# EAGLE design EHM (EAGLE 9.3.0)

## Sheet 1 of 2
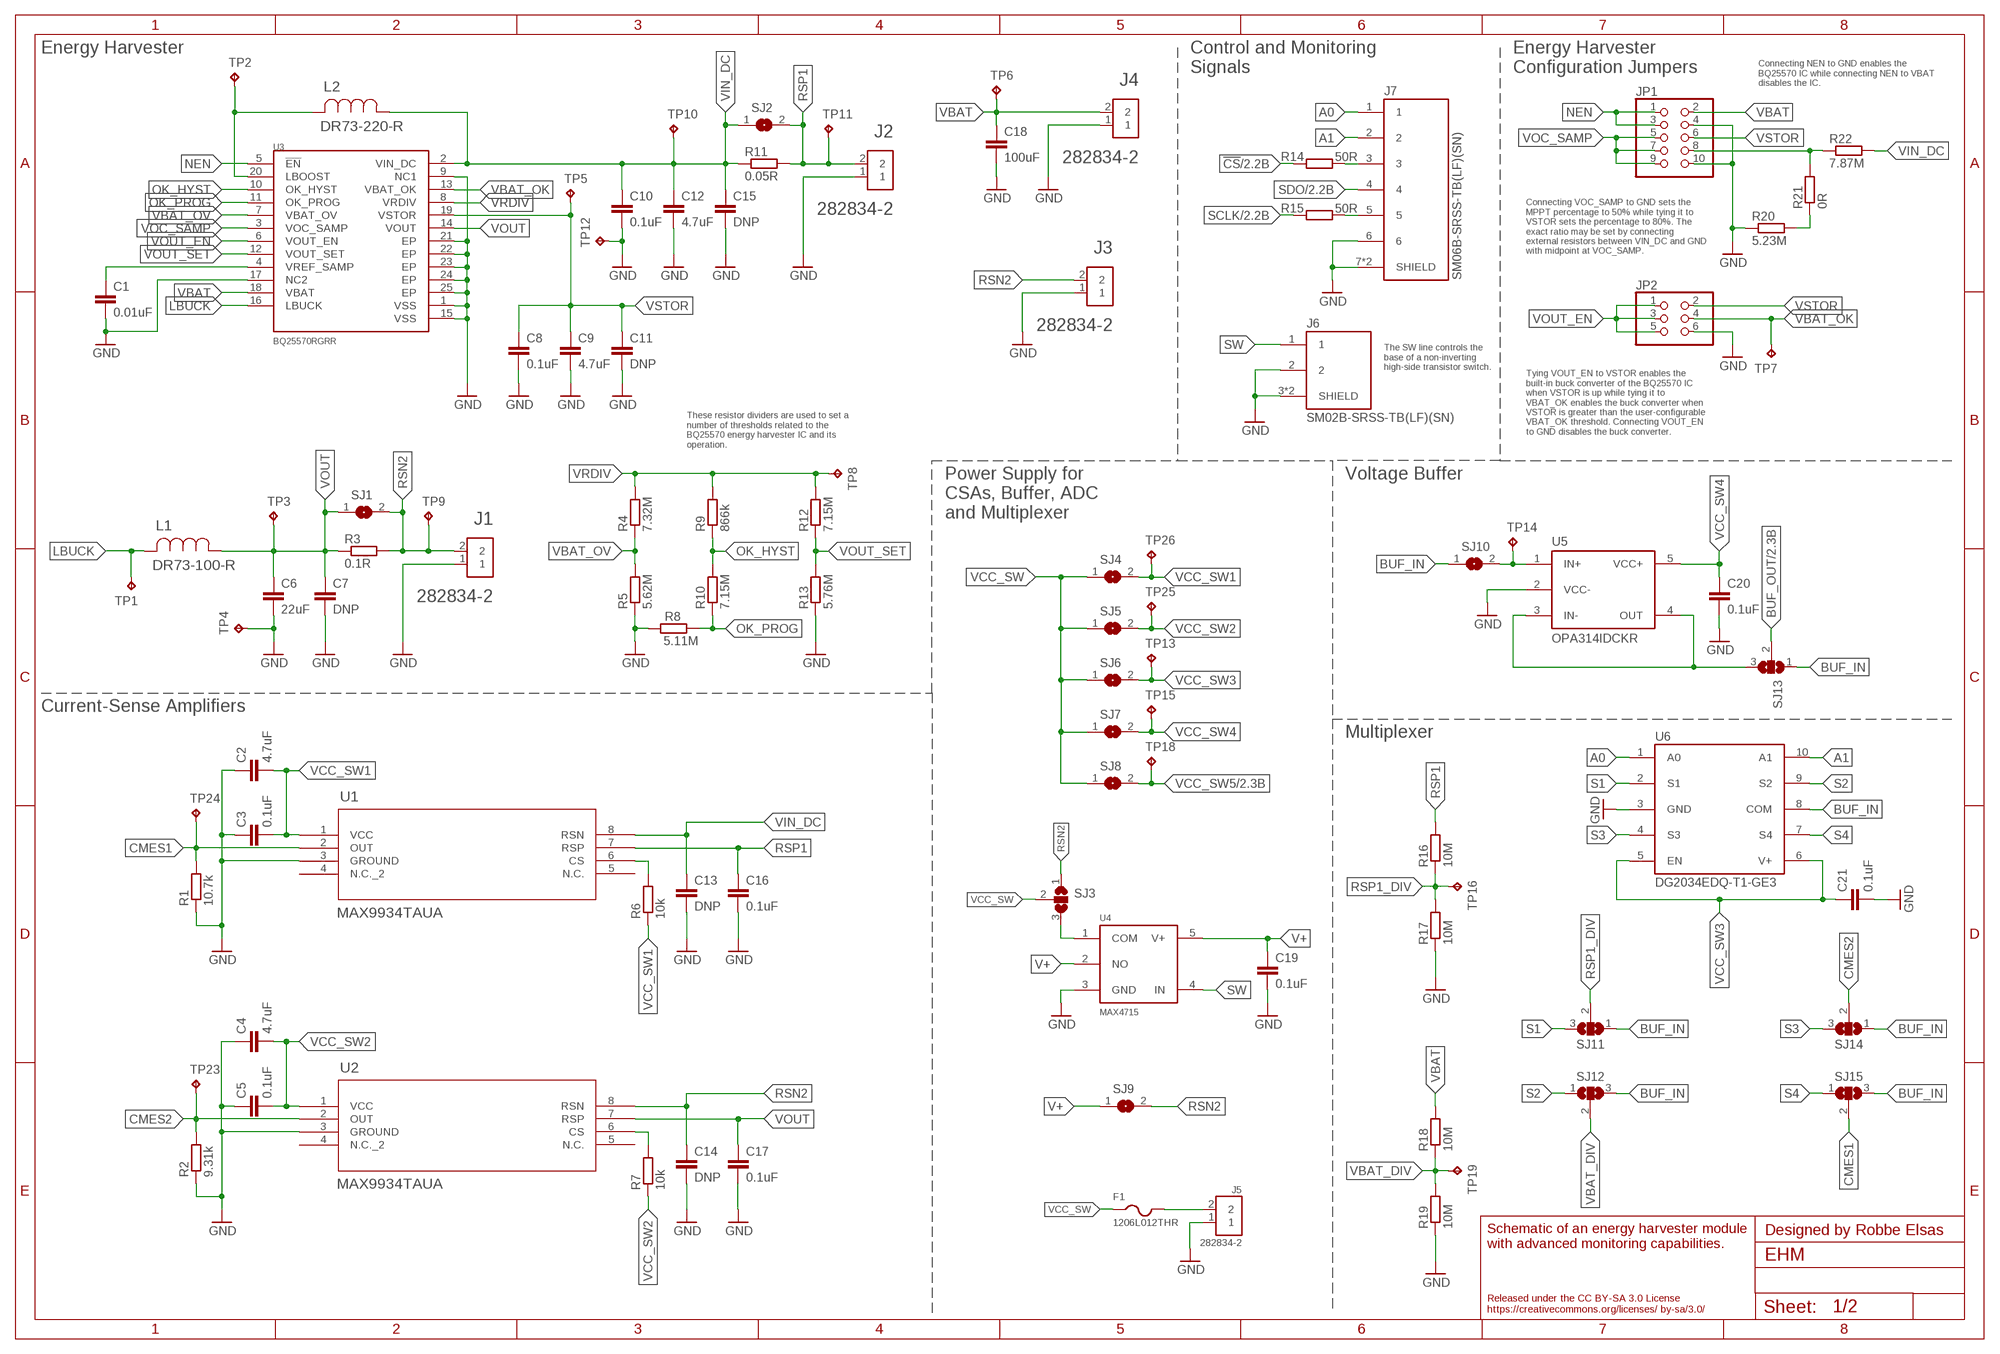
[diagram p0: schematic, sheet 1]

### Parts
C1  0.01uF  C-EUC0805  [C0805]
C2  4.7uF  C-EUC0805  [C0805]
C3  0.1uF  C-EUC0805  [C0805]
C4  4.7uF  C-EUC0805  [C0805]
C5  0.1uF  C-EUC0805  [C0805]
C6  22uF  C-EUC0805  [C0805]
C7  DNP  C-EUC0805  [C0805]
C8  0.1uF  C-EUC0805  [C0805]
C9  4.7uF  C-EUC0805  [C0805]
C10  0.1uF  C-EUC0805  [C0805]
C11  DNP  C-EUC0805  [C0805]
C12  4.7uF  C-EUC0805  [C0805]
C13  DNP  C-EUC0805  [C0805]
C14  DNP  C-EUC0805  [C0805]
C15  DNP  C-EUC0805  [C0805]
C16  0.1uF  C-EUC0805  [C0805]
C17  0.1uF  C-EUC0805  [C0805]
C18  100uF  C-EUC1210  [C1210]
C19  0.1uF  C-EUC0805  [C0805]
C20  0.1uF  C-EUC0805  [C0805]
C21  0.1uF  C-EUC0805  [C0805]
F1  1206L012THR  [R1206]
J1  282834-2  [CONN_282834-2]
J2  282834-2  [CONN_282834-2]
J3  282834-2  [CONN_282834-2]
J4  282834-2  [CONN_282834-2]
J5  282834-2  [CONN_282834-2]
J6  SM02B-SRSS-TB(LF)(SN)  [SM02B-SRSS-TB]
J7  SM06B-SRSS-TB(LF)(SN)  [SM06B-SRSS-B]
JP1  PINHD-2X5  [2X05]
JP2  PINHD-2X3  [2X03]
L1  DR73-100-R  [DR73]
L2  DR73-220-R  [DR73]
R1  10.7k  R-EU_R0603  [R0603]
R2  9.31k  R-EU_R0603  [R0603]
R3  0.1R  Y14870RXX000B9R  [Y14870RXX000B9R]
R4  7.32M  R-EU_R0603  [R0603]
R5  5.62M  R-EU_R0603  [R0603]
R6  10k  R-EU_R0603  [R0603]
R7  10k  R-EU_R0603  [R0603]
R8  5.11M  R-EU_R0603  [R0603]
R9  866k  R-EU_R0603  [R0603]
R10  7.15M  R-EU_R0603  [R0603]
R11  0.05R  Y14870RXX000B9R  [Y14870RXX000B9R]
R12  7.15M  R-EU_R0603  [R0603]
R13  5.76M  R-EU_R0603  [R0603]
R14  50R  R-EU_R0603  [R0603]
R15  50R  R-EU_R0603  [R0603]
R16  10M  R-EU_R0603  [R0603]
R17  10M  R-EU_R0603  [R0603]
R18  10M  R-EU_R0603  [R0603]
R19  10M  R-EU_R0603  [R0603]
R20  5.23M  R-EU_R0603  [R0603]
R21  0R  R-EU_R0603  [R0603]
R22  7.87M  R-EU_R0603  [R0603]
SJ1  SJ  [SJ]
SJ2  SJ  [SJ]
SJ3  SJ2W  [SJ_2]
SJ4  SJ  [SJ]
SJ5  SJ  [SJ]
SJ6  SJ  [SJ]
SJ7  SJ  [SJ]
SJ8  SJ  [SJ]
SJ9  SJ  [SJ]
SJ10  SJ  [SJ]
SJ11  SJ2W  [SJ_2]
SJ12  SJ2W  [SJ_2]
SJ13  SJ2W  [SJ_2]
SJ14  SJ2W  [SJ_2]
SJ15  SJ2W  [SJ_2]
TP1  TPPAD1-13  [P1-13]
TP2  TPB1,27  [B1,27]
TP3  TPB1,27  [B1,27]
TP4  TPPAD1-13  [P1-13]
TP5  TPB1,27  [B1,27]
TP6  TPPAD1-13  [P1-13]
TP7  TPPAD1-13  [P1-13]
TP8  TPPAD1-13  [P1-13]
TP9  TPB1,27  [B1,27]
TP10  TPB1,27  [B1,27]
TP11  TPPAD1-13  [P1-13]
TP12  TPPAD1-13  [P1-13]
TP13  TPB1,27  [B1,27]
TP14  TPB1,27  [B1,27]
TP15  TPB1,27  [B1,27]
TP16  TPPAD1-13  [P1-13]
TP18  TPB1,27  [B1,27]
TP19  TPPAD1-13  [P1-13]
TP23  TPPAD1-13  [P1-13]
TP24  TPPAD1-13  [P1-13]
TP25  TPB1,27  [B1,27]
TP26  TPB1,27  [B1,27]
U1  MAX9934TAUA  [21-0036K]
U2  MAX9934TAUA  [21-0036K]
U3  BQ25570RGRR  [QFN50P350X350X100-21N]
U4  MAX4715  [SC70-5L]
U5  OPA314IDCKR  [SC70-5L]
U6  DG2034EDQ-T1-GE3  [MSOP10]

### Nets
!CS!: R14.1 ; also sheet 2
A0: J7.1 U6.1(A0)
A1: J7.2 U6.10(A1)
BUF_IN: SJ10.1 SJ11.1 SJ12.3 SJ13.1 SJ14.1 SJ15.3 U6.8(COM)
BUF_OUT: SJ13.2 ; also sheet 2
CMES1: R1.2 SJ15.2 TP24.TP U1.2(OUT)
CMES2: R2.2 SJ14.2 TP23.TP U2.2(OUT)
GND: C1.2 C2.1 C3.1 C4.1 C5.1 C6.2 C7.2 C8.2 C9.2 C10.2 C11.2 C12.2 C13.2 C14.2 C15.2 C16.2 C17.2 C18.2 C19.2 C20.2 C21.2 J1.1 J2.1 J3.1 J4.1 J5.1 J6.2 J6.3(SHIELD) J6.4(SHIELD) J7.6 J7.7(SHIELD) J7.8(SHIELD) JP1.4 JP1.10 JP2.6 R1.1 R2.1 R5.1 R8.1 R13.1 R17.1 R19.1 R20.1 TP4.TP TP12.TP U1.3(GROUND) U2.3(GROUND) U3.1(VSS) U3.9(NC1) U3.15(VSS) U3.17(NC2) U3.21(EP) U3.22(EP) U3.23(EP) U3.24(EP) U3.25(EP) U4.3(GND) U5.2(VCC-) U6.3(GND) ; also sheet 2
LBOOST: L2.2 TP2.TP U3.20(LBOOST)
LBUCK: L1.2 TP1.TP U3.16(LBUCK)
N$2: R20.2 R21.1
N$3: JP1.8 R21.2 R22.1
N$4: R6.2 U1.6(CS)
N$6: F1.2 J5.2
N$7: R7.2 U2.6(CS)
N$8: SJ10.2 TP14.TP U5.1(IN+)
N$9: J7.3 R14.2
N$10: SJ3.3 U4.1(COM)
N$12: J7.5 R15.2
N$27: SJ13.3 U5.3(IN-) U5.4(OUT)
NEN: JP1.1 JP1.3 U3.5(!EN)
OK_HYST: R9.1 R10.2 U3.10(OK_HYST)
OK_PROG: R8.2 R10.1 U3.11(OK_PROG)
RSN2: C14.1 J1.2 J3.2 R3.P$3 R3.P$4 SJ1.2 SJ3.1 SJ9.2 TP9.TP U2.8(RSN)
RSP1: C16.1 J2.2 R11.P$3 R11.P$4 R16.2 SJ2.2 TP11.TP U1.7(RSP)
RSP1_DIV: R16.1 R17.2 SJ11.2 TP16.TP
S1: SJ11.3 U6.2(S1)
S2: SJ12.1 U6.9(S2)
S3: SJ14.3 U6.4(S3)
S4: SJ15.1 U6.7(S4)
SCLK: R15.1 ; also sheet 2
SDO: J7.4 ; also sheet 2
SW: J6.1 U4.4(IN)
V+: C19.1 SJ9.1 U4.2(NO) U4.5(V+)
VBAT: C18.1 J4.2 JP1.2 R18.2 TP6.TP U3.18(VBAT)
VBAT_DIV: R18.1 R19.2 SJ12.2 TP19.TP
VBAT_OK: JP2.4 TP7.TP U3.13(VBAT_OK)
VBAT_OV: R4.1 R5.2 U3.7(VBAT_OV)
VCC_SW: F1.1 SJ3.2 SJ4.1 SJ5.1 SJ6.1 SJ7.1 SJ8.1
VCC_SW1: C2.2 C3.2 R6.1 SJ4.2 TP26.TP U1.1(VCC)
VCC_SW2: C4.2 C5.2 R7.1 SJ5.2 TP25.TP U2.1(VCC)
VCC_SW3: C21.1 SJ6.2 TP13.TP U6.5(EN) U6.6(V+)
VCC_SW4: C20.1 SJ7.2 TP15.TP U5.5(VCC+)
VCC_SW5: SJ8.2 TP18.TP ; also sheet 2
VIN_DC: C10.1 C12.1 C13.1 C15.1 L2.1 R11.P$1 R11.P$2 R22.2 SJ2.1 TP10.TP U1.8(RSN) U3.2(VIN_DC)
VOC_SAMP: JP1.5 JP1.7 JP1.9 U3.3(VOC_SAMP)
VOUT: C6.1 C7.1 C17.1 L1.1 R3.P$1 R3.P$2 SJ1.1 TP3.TP U2.7(RSP) U3.14(VOUT)
VOUT_EN: JP2.1 JP2.3 JP2.5 U3.6(VOUT_EN)
VOUT_SET: R12.1 R13.2 U3.12(VOUT_SET)
VRDIV: R4.2 R9.2 R12.2 TP8.TP U3.8(VRDIV)
VREF_SAMP: C1.1 U3.4(VREF_SAMP)
VSTOR: C8.1 C9.1 C11.1 JP1.6 JP2.2 TP5.TP U3.19(VSTOR)
Unconnected: U1.4(N.C._2) U1.5(N.C.) U2.4(N.C._2) U2.5(N.C.)

### Notes on the sheet
- Energy Harvester
- Control and Monitoring
  Signals
- Energy Harvester 
  Configuration Jumpers
- Connecting NEN to GND enables the 
  BQ25570 IC while connecting NEN to VBAT 
  disables the IC.
- Connecting VOC_SAMP to GND sets the 
  MPPT percentage to 50% while tying it to 
  VSTOR sets the percentage to 80%. The 
  exact ratio may be set by connecting 
  external resistors between VIN_DC and GND 
  with midpoint at VOC_SAMP.
- The SW line controls the 
  base of a non-inverting 
  high-side transistor switch.
- Tying VOUT_EN to VSTOR enables the 
  built-in buck converter of the BQ25570 IC 
  when VSTOR is up while tying it to 
  VBAT_OK enables the buck converter when 
  VSTOR is greater than the user-configurable 
  VBAT_OK threshold. Connecting VOUT_EN 
  to GND disables the buck converter.
- These resistor dividers are used to set a 
  number of thresholds related to the 
  BQ25570 energy harvester IC and its 
  operation.
- Voltage Buffer
- Power Supply for
  CSAs, Buffer, ADC
  and Multiplexer
- Current-Sense Amplifiers
- Multiplexer
- Designed by Robbe Elsas
- Schematic of an energy harvester module 
  with advanced monitoring capabilities.
- Released under the CC BY-SA 3.0 License 
  https://creativecommons.org/licenses/ by-sa/3.0/

## Sheet 2 of 2
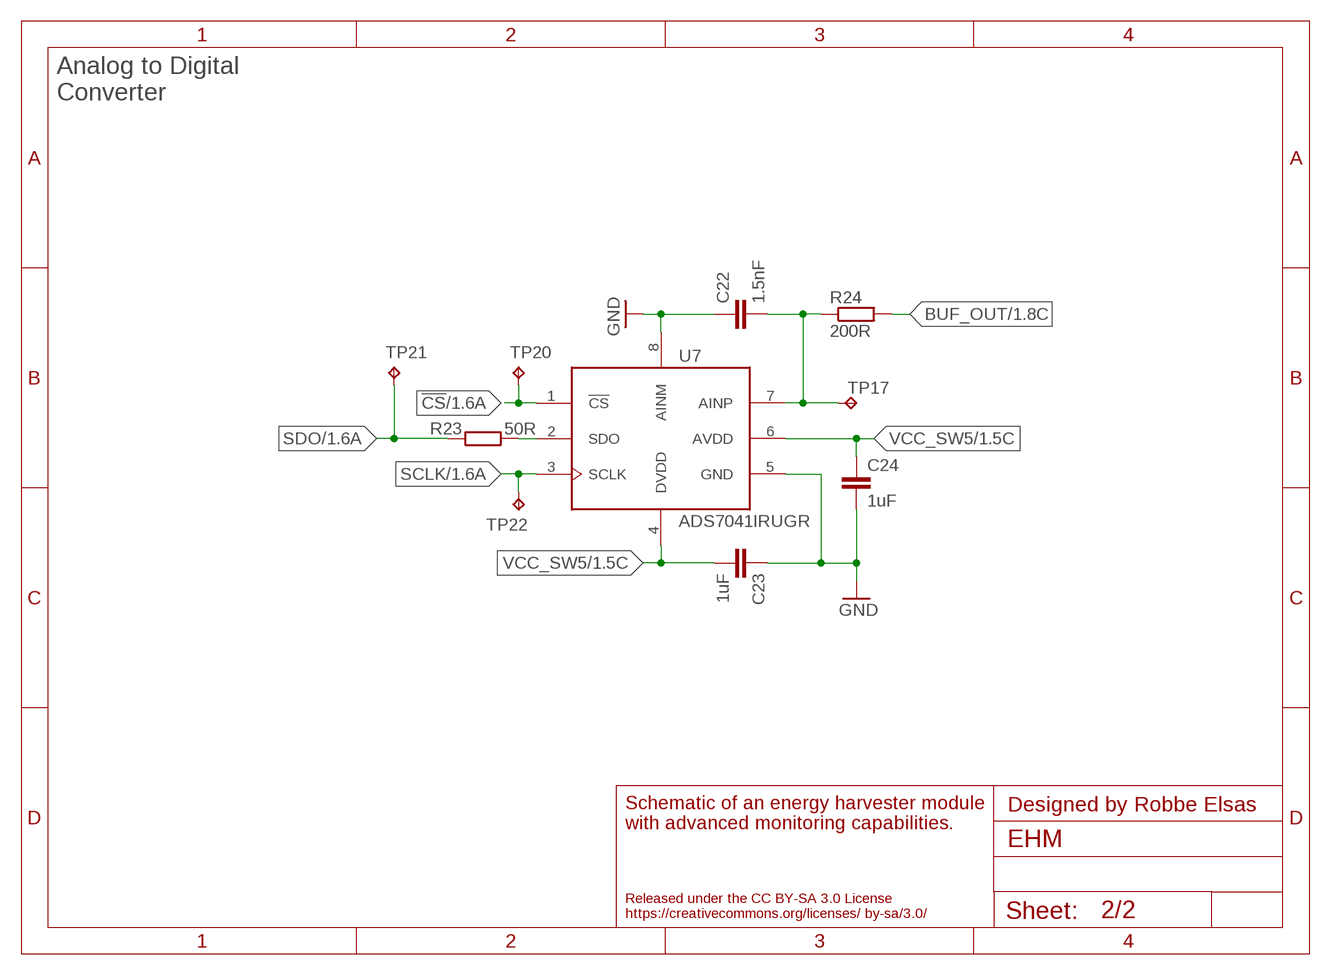
[diagram p1: schematic, sheet 2]

### Parts
C22  1.5nF  C-EUC0603  [C0603]
C23  1uF  C-EUC0805  [C0805]
C24  1uF  C-EUC0805  [C0805]
R23  50R  R-EU_R0603  [R0603]
R24  200R  R-EU_R0603  [R0603]
TP17  TPB1,27  [B1,27]
TP20  TPB1,27  [B1,27]
TP21  TPB1,27  [B1,27]
TP22  TPB1,27  [B1,27]
U7  ADS7041IRUGR  [QFN50P150X150X40-8N]

### Nets
!CS!: TP20.TP U7.1(!CS!) ; also sheet 1
BUF_OUT: R24.2 ; also sheet 1
GND: C22.1 C23.1 C24.2 U7.5(GND) U7.8(AINM) ; also sheet 1
N$5: R23.2 U7.2(SDO)
N$13: C22.2 R24.1 TP17.TP U7.7(AINP)
SCLK: TP22.TP U7.3(SCLK) ; also sheet 1
SDO: R23.1 TP21.TP ; also sheet 1
VCC_SW5: C23.2 C24.1 U7.4(DVDD) U7.6(AVDD) ; also sheet 1

### Notes on the sheet
- Analog to Digital
  Converter
- Designed by Robbe Elsas
- Schematic of an energy harvester module 
  with advanced monitoring capabilities.
- Released under the CC BY-SA 3.0 License 
  https://creativecommons.org/licenses/ by-sa/3.0/

## Library data of the parts
C1-C24 = rcl:C-EU: CAPACITOR, European symbol; SPICEPREFIX: C
F1 = 1206L012THR:1206L012THR
J1-J5 = 282834-2:282834-2: Terminal block; 2.54mm; angled 90°; 0.03÷1mm2; ways: 2; 10A; H: 10mm; AVAILABILITY: Unavailable; CENTERLINE_PITCH: 2.54 mm[.1 in]; COMMENT: 282834-2; DESCRIPTION: TERMI-BLOK PCB MOUNT, 90 2P.; EU_ROHS_COMPLIANCE: Compliant with Exemptions; MF: TE Connectivity; MP: 282834-2; NUMBER_OF_POSITIONS: 2; PACKAGE: None; PRICE: None; TE_PURCHASE_URL: https://www.te.com/usa-en/product-282834-2.html?te_bu=Cor&te_type=disp&te_campaign=seda_glo_cor-seda-global-disp-prtnr-fy19-seda-model-bom-cta_sma-317_1&elqCampaignId=32493
J6 = SM02B-SRSS-TB(LF)(SN):SM02B-SRSS-TB(LF)(SN): CONN HEADER SH 2POS SIDE 1MM TIN Source: Datasheet <http://www.jst-mfg.com/product/pdf/eng/eSH.pdf>
J7 = SM06B-SRSS-TB(LF)(SN):SM06B-SRSS-TB(LF)(SN): JST (JAPAN SOLDERLESS TERMINALS) - SM06B-SRSS-TB(LF)(SN) - CONNECTOR, HEADER, SMT, R/A, 1MM, 6WAY Source: Datasheet <http://www.jst-mfg.com/product/pdf/eng/eSH.pdf>
JP1 = pinhead:PINHD-2X5: PIN HEADER
JP2 = pinhead:PINHD-2X3: PIN HEADER
L1 = DR73-100-R:DR73-100-R: POWER INDUCTOR
L2 = DR73-220-R:DR73-220-R: POWER INDUCTOR
R1 R2 R4-R10 R12-R24 = rcl:R-EU_: RESISTOR, European symbol; SPICEPREFIX: R
R3 R11 = Y14870RXX000B9R:Y14870RXX000B9R
SJ1 SJ2 SJ4-SJ10 = jumper:SJ: SMD solder JUMPER
SJ3 SJ11-SJ15 = jumper:SJ2W: SMD solder JUMPER
TP1-TP26 = testpad:TP: Test pad
U1 U2 = MAX9934TAUA:MAX9934TAUA; DESCRIPTION: Linear IC - Op-amp Maxim Integrated MAX9934TAUA+ Current sensor uMAX 8; DIGI-KEY_PART_NUMBER: MAX9934TAUA+-ND; DIGI-KEY_PURCHASE_URL: https://www.digikey.be/product-detail/en/maxim-integrated/MAX9934TAUA-/MAX9934TAUA--ND/2239130?utm_source=snapeda&utm_medium=aggregator&utm_campaign=symbol; MF: Maxim Integrated; MP: MAX9934TAUA+; PACKAGE: MSOP-8 Maxim Integrated
U3 = BQ25570RGRR:BQ25570RGRR: Ultra Low Power Harvester Power Management IC with Boost Charger, and Nanopower Buck Converter 20-VQFN; AVAILABILITY: Unavailable; DESCRIPTION: Ultra Low Power Harvester Power Management IC with Boost Charger, and Nanopower Buck Converter 20-VQFN; MF: Texas Instruments; MP: BQ25570RGRR; PACKAGE: VQFN-20 Texas Instruments; PRICE: None
U4 = MAX4715:MAX4715
U5 = OPA314IDCK:OPA314IDCKR
U6 = DG2034EDQ-T1-GE3:DG2034EDQ-T1-GE3
U7 = ADS7041IRUG:ADS7041IRUGR

## Board
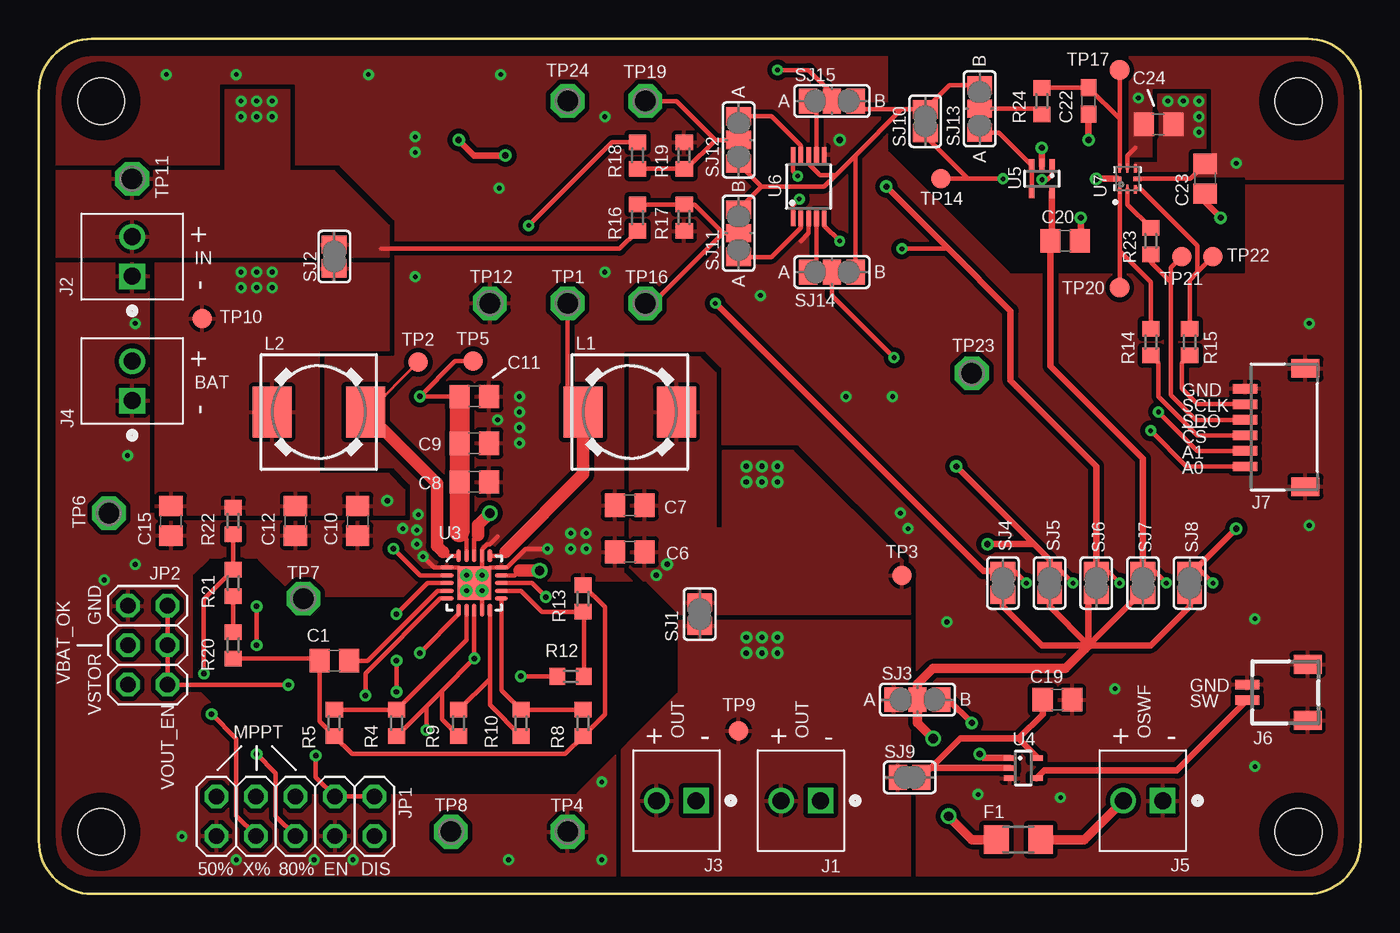
[diagram p2: board, top side]
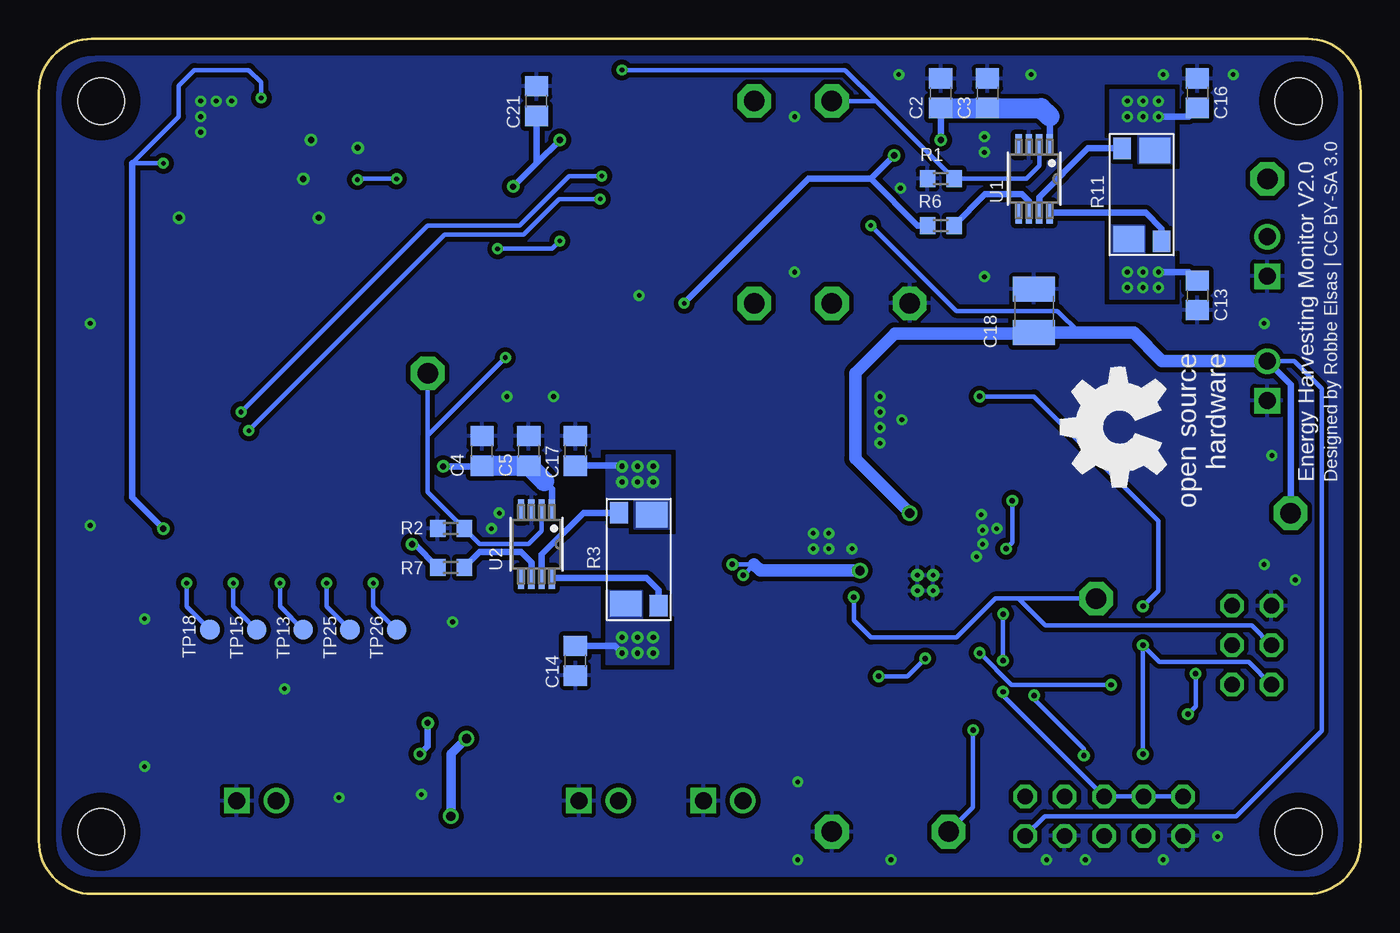
[diagram p3: board, bottom side, seen from below]

Size 85 x 55 mm. Coordinates in mm from the lower left corner, seen from the top.
Outline: 81.59,0 3.41,0 arc-90 0,3.41 0,51.59 arc-90 3.41,55 81.59,55 arc-90 85,51.59 85,3.41 arc-90 81.59,0
Copper layers (1*16): Top 0.035mm / dielectric 1.5mm / Bottom 0.035mm
Design rules "default *": minimum track width 6mil, minimum drill 0.3mm, track to track 6mil, track to pad 6mil, pad to pad 6mil, via to via 6mil, smd to smd 6mil, copper to edge 40mil, drill to drill 6mil, minimum pad ring 10mil, minimum via ring 8mil, stop-mask expansion 4mil, vias tented up to drill 0mil, thermal gap 10mil
Holes 3 mm at 4,51 81,51 81,4 4,4

### Footprints (pad centres in the part's own frame; a part is rotated, then mirrored left to right if it is on the bottom)
C0805 = smd 1.3 x 1.5: 1 -0.95,0; 2 0.95,0
C1210 = smd 1.6 x 2.7: 1 -1.4,0; 2 1.4,0
C0603 = smd 1.1 x 1: 1 -0.85,0; 2 0.85,0
R1206 = smd 1.6 x 1.803: 1 -1.422,0; 2 1.422,0
CONN_282834-2 = drill 1.1 square: 1 -1.27,0 | drill 1.1: 2 1.27,0
SM02B-SRSS-TB = smd 0.6 x 1.55: 1 -0.532,2.289; 2 0.468,2.289 | smd 1.2 x 1.8: 3 -1.832,-1.586; 4 1.768,-1.586
SM06B-SRSS-B = smd 0.6 x 1.55: 1 -2.5,2.432; 2 -1.5,2.432; 3 -0.5,2.432; 4 0.5,2.432; 5 1.5,2.432; 6 2.5,2.432 | smd 1.2 x 1.8: 7 3.8,-1.443; 8 -3.8,-1.443
2X05 = drill 1.016 octagon: 1 -5.08,-1.27; 2 -5.08,1.27; 3 -2.54,-1.27; 4 -2.54,1.27; 5 0,-1.27; 6 0,1.27; 7 2.54,-1.27; 8 2.54,1.27; 9 5.08,-1.27; 10 5.08,1.27
2X03 = drill 1.016 octagon: 1 -2.54,-1.27; 2 -2.54,1.27; 3 0,-1.27; 4 0,1.27; 5 2.54,-1.27; 6 2.54,1.27
DR73 = smd 2.5 x 3.25: 1 -3,0; 2 3,0
R0603 = smd 1 x 1.1: 1 -0.85,0; 2 0.85,0
Y14870RXX000B9R = smd 1.39 x 1.14: P$1 -3.014,-1.197; P$3 2.956,1.343 | smd 1.65 x 2.01: P$2 -2.884,0.908; P$4 2.826,-0.762
SJ = smd 1.168 x 1.6: 1 -0.762,0; 2 0.762,0
SJ_2 = smd 1.168 x 1.6: 1 -1.524,0; 2 0,0; 3 1.524,0
P1-13 = drill 1.321 pad 2.159 octagon: TP 0,0
B1,27 = smd 1.27 x 1.27: TP 0,0
21-0036K = smd 1.372 x 0.406: 1 -2.184,0.991; 2 -2.184,0.33; 3 -2.184,-0.33; 4 -2.184,-0.991; 5 2.184,-0.991; 6 2.184,-0.33; 7 2.184,0.33; 8 2.184,0.991
QFN50P350X350X100-21N = smd 0.85 x 0.3: 1 -1.75,1; 2 -1.75,0.5; 3 -1.75,0; 4 -1.75,-0.5; 5 -1.75,-1; 11 1.75,-1; 12 1.75,-0.5; 13 1.75,0; 14 1.75,0.5; 15 1.75,1 | smd 0.3 x 0.85: 6 -1,-1.75; 7 -0.5,-1.75; 8 0,-1.75; 9 0.5,-1.75; 10 1,-1.75; 16 1,1.75; 17 0.5,1.75; 18 0,1.75; 19 -0.5,1.75; 20 -1,1.75 | smd 2.15 x 2.15: 21 0,0 | drill 0.3 pad 0.45: 22 -0.5,0.5; 23 -0.5,-0.5; 24 0.5,-0.5; 25 0.5,0.5
SC70-5L = smd 0.35 x 0.8: 1 -0.65,-0.85; 2 0,-0.85; 3 0.65,-0.85; 4 0.65,0.85; 5 -0.65,0.85
MSOP10 = smd 0.3 x 1: 1 -1,-2.05; 2 -0.5,-2.05; 3 0,-2.05; 4 0.5,-2.05; 5 1,-2.05; 6 1,2.05; 7 0.5,2.05; 8 0,2.05; 9 -0.5,2.05; 10 -1,2.05
QFN50P150X150X40-8N = smd 0.55 x 0.25: 1 -0.675,0.5; 3 -0.675,-0.5; 5 0.675,-0.5; 7 0.675,0.5 | smd 0.55 x 0.2: 2 -0.675,0; 6 0.675,0 | smd 0.3 x 0.6: 4 0,-0.65; 8 0,0.65

### Placement (x,y rotation side)
C1  19,15 180 top
C2  27,51.5 270 bottom
C3  24,51.5 270 bottom
C4  56.5,28.5 270 bottom
C5  53.5,28.5 270 bottom
C6  38,22 180 top
C7  38,25 180 top
C8  28,26.5 0 top
C9  28,29 0 top
C10  20.5,24 270 top
C11  28,32 0 top
C12  16.5,24 270 top
C13  10.5,38.5 270 bottom
C14  50.5,15 270 bottom
C15  8.5,24 270 top
C16  10.5,51.5 90 bottom
C17  50.5,28.5 90 bottom
C18  21,37.5 90 bottom
C19  65.5,12.5 0 top
C20  66,42 0 top
C21  53,51 90 bottom
C22  67.5,51 90 top
C23  75,46 90 top
C24  72,49.5 0 top
F1  63,3.5 0 top
J1  49,6 180 top
J2  6,41 90 top
J3  41,6 180 top
J4  6,33 90 top
J5  71,6 180 top
J6  80,13 90 top
J7  80,30 90 top
JP1  16.5,5 180 top
JP2  7,16 90 top
L1  38,31 180 top
L2  18,31 0 top
R1  27,46 0 bottom
R2  58.5,23.5 0 bottom
R3  46.5,21.5 270 bottom
R4  23,11 270 top
R5  19,11 90 top
R6  27,43 0 bottom
R7  58.5,21 0 bottom
R8  35,11 90 top
R9  27,11 270 top
R10  31,11 270 top
R11  14,45 90 bottom
R12  34.2,14 180 top
R13  35,19 270 top
R14  71.5,35.5 270 top
R15  74,35.5 270 top
R16  38.5,43.5 270 top
R17  41.5,43.5 90 top
R18  38.5,47.5 90 top
R19  41.5,47.5 270 top
R20  12.5,16 90 top
R21  12.5,20 90 top
R22  12.5,24 90 top
R23  71.5,42 90 top
R24  64.5,51 270 top
SJ1  42.5,18 270 top
SJ2  19,41 90 top
SJ3  56.5,12.5 0 top
SJ4  62,20 90 top
SJ5  65,20 90 top
SJ6  68,20 90 top
SJ7  71,20 90 top
SJ8  74,20 90 top
SJ9  56,7.5 180 top
SJ10  57,49.7 270 top
SJ11  45,42.5 270 top
SJ12  45,48.5 270 top
SJ13  60.5,50.5 270 top
SJ14  51,40 180 top
SJ15  51,51 0 top
TP1  34,38 270 top
TP2  24.4,34.2 180 top
TP3  55.5,20.5 90 top
TP4  34,4 270 top
TP5  27.92,34.28 0 top
TP6  4.5,24.5 0 top
TP7  17,19 90 top
TP8  26.5,4 180 top
TP9  45,10.5 180 top
TP10  10.5,37 0 top
TP11  6,46 90 top
TP12  29,38 270 top
TP13  68,17 90 bottom
TP14  58,46 0 top
TP15  71,17 90 bottom
TP16  39,38 0 top
TP17  69.5,53 0 top
TP18  74,17 90 bottom
TP19  39,51 0 top
TP20  69.5,39 0 top
TP21  73.5,41 0 top
TP22  75.5,41 0 top
TP23  60,33.5 180 top
TP24  34,51 90 top
TP25  65,17 90 bottom
TP26  62,17 90 bottom
U1  21,46 270 bottom
U2  53,22.5 270 bottom
U3  28,20 0 top
U4  63.3,8.1 270 top
U5  64.5,46 180 top
U6  49.5,45.5 0 top
U7  70,46 90 top
U$1  [OSHW_8MM]  15.5,30 90 bottom

### Tracks (layer width: path | path; a pad name or v marks a point on that pad's centre or on a via)
!CS!
  Top 0.305: U7.1 69.5,41.35 | R14.1 71.5,39.35 69.5,41.35 | TP20.TP 69.5,41.35
A0  (via drill 0.3)
  Top 0.305: U6.1 48.5,44.3 v48.9,44.7 | v71.5,29.8 73.8,27.5 J7.1
  Bottom 0.305: v48.9,44.7 51.54,44.7 53.84,42.4 58.9,42.4 v71.5,29.8
A1  (via drill 0.3)
  Top 0.305: U6.10 48.5,46.5 48.8,46.2 v48.8,46.18 | v72,31 74.5,28.5 J7.2
  Bottom 0.305: v72,31 60,43 54.08,43 50.9,46.18 v48.8,46.18
BUF_IN
  Top 0.305: SJ10.1 57.02,50.48 | 57.02,50.48 58.56,52.02 SJ13.1 | 51.25,46.25 50.5,45.5 46.48,45.5 | SJ12.3 46.48,45.5 | SJ11.1 46.48,45.5 | U6.8 49.5,46.97 50.22,46.25 51.25,46.25 | 51.25,46.25 52.5,47.5 | 52.5,47.5 55.48,50.48 | 55.48,50.48 57.02,50.48 | SJ15.3 53.04,50.48 55.48,50.48 | SJ14.1 52.52,47.48 52.5,47.5
BUF_OUT
  Top 0.305: SJ13.2 64.15,50.5 R24.2
CMES1  (via drill 0.3)
  Top 0.305: v47.5,53 49.5,53 51,51.5 SJ15.2
  Bottom 0.305: U1.2 20.67,46.83 21.5,46 R1.2 31.15,51 | 31.15,51 33.15,53 v47.5,53 | TP24.TP 31.15,51
CMES2  (via drill 0.3)
  Top 0.305: v55,34.5 51,38.5 SJ14.2
  Bottom 0.305: U2.2 52.67,23.34 53.5,22.51 56.66,22.51 R2.2 60,25.85 60,29.5 | 60,29.5 v55,34.5 | TP23.TP 60,29.5
GND  (via drill 0.3, 0.4)
  Top 0.305: R13.1 36.4,18.45 36.4,11.55 R8.1 33.85,9 20.15,9 R5.1 18.05,11.1 C1.2 17.9,15.15 12.8,15.15 | R20.1 12.65,15 | v24.7,21.7 25.4,21 U3.1 27,21 U3.21 | v32.7,22.2 31.29,22.2 30.09,21 U3.15 29,21 U3.21 | U3.9 U3.24 U3.21 | U3.21 U3.25 U3.17 28.5,22.17 28.81,22.48 28.98,22.48 29.5,23 | U6.3 49.5,42.5 49,42
  Top 0.406: 12.8,15.15 12.65,15 | U7.8 v68,46 | C20.2 67,42.05 v67,43.5 | U5.2 v64.5,48 | C22.1 v67.5,48.5 | C23.1 75,44.5 v76,43.5
  other vias: 24.4,24.4 24.3,23.4 24.3,22.5 23.4,23.5 34.2,22.2 35.2,23.2 35.2,22.2 34.2,23.2 30.2,2.2 6.2,21.2 5.7,28.2 30.9,32 30.9,31 30.9,30 30.9,29 6.2,36.7 24.2,39.7 29.5,30.5 9.2,3.7 17.7,2.2 20.2,2.2 12.7,2.2 4.2,20.2 36.2,7.2 36.2,2.2 74.6,51 74.6,50 74.6,49 72.6,51 73.6,51 65.7,6.2 78.2,8.2 78.2,17.7 69.2,13.2 24.2,48.7 24.2,47.7 21.2,52.7 29.7,52.7 8.2,52.7 12.7,52.7 29.6,45.4 55.4,24.5 55.9,23.5 60.4,6.4 46.4,38.5 81.7,36.7 51.9,32 54.9,32 36.4,40 36.4,50 81.7,23.7 58.4,17.5
  pour Top (isolate 0.305, rank 6): 0,0 0,55 85,55 85,0
  pour Bottom (isolate 0.305, rank 6): 0,0 0,55 85,55 85,0
  pour Top (isolate 0.305): 72,51.4 75,51.4 75,46 70,46 70,47 72,47
  pour Top (isolate 0.305, no thermals): 72,51.4 75,51.4 75,46 70,46 70,47 72,47
LBOOST
  Top 0.2: TP2.TP 21.2,31 L2.2
  Top 0.305: 26,22 26.25,21.75 U3.20
  Top 0.813: L2.2 25.6,26.4 25.6,22.4 26,22
LBUCK
  Top 0.305: 30,22 29.75,21.75 U3.16 | TP1.TP 34,32 L1.2
  Top 0.813: L1.2 35,27 30,22
N$2
  Top 0.305: R21.1 R20.2
N$3  (via drill 0.35)
  Top 0.305: R22.1 R21.2 10.61,18.96 v10.61,14.17 | JP1.8 13.96,3.76 12.69,5.03 12.69,9.99 v11.11,11.57
  Bottom 0.305: v10.61,14.17 10.61,12.07 v11.11,11.57
N$4
  Bottom 0.406: R6.2 24.15,45 21.78,45 21.33,44.55 U1.6
N$5
  Top 0.305: U7.2 70,44.35 R23.2
N$6
  Top 0.61: J5.2 67.23,3.5 F1.2
N$7
  Bottom 0.406: R7.2 56.65,22 54,22 53.33,21.33 U2.6
N$8  (via drill 0.3)
  Top 0.305: 59.74,46 57,48.74 SJ10.2 | 59.74,46 v62,46 | v64.51,45.94 64.84,45.94 65.15,46.25 U5.1 | TP14.TP 59.74,46
  Bottom 0.305: v62,46 64.45,46 v64.51,45.94
N$9
  Top 0.305: R14.2 72,34.15 72,32 74.5,29.5 J7.3
N$10  (via drill 0.4)
  Top 0.406: SJ3.3 58.5,12.5 v60,11 | v60.5,9 60.75,8.75 U4.1
  Bottom 0.406: v60.5,9 60,9.5 v60,11
N$12
  Top 0.305: R15.2 73.5,34.15 73.5,32.5 74.5,31.5 J7.5
N$13
  Top 0.305: R24.1 C22.2 69.5,49.85 | 69.5,49.85 U7.7 | TP17.TP 69.5,49.85
N$14
  cutout Top (isolate 0.305): 54.7,55 54.7,47.8 62.5,40 77.5,40 77.5,46 70,46 70,55
N$22
  cutout Top (isolate 0.305): 34.5,6.5 41,13 41,18 39,20 30.5,20 30.5,19 16.5,19 14,21.5 11,21.5 10,20.5 10,13.5 17,6.5
N$27
  Top 0.305: SJ13.3 61.72,48.98 U5.3 U5.4
NEN  (via drill 0.35)
  Top 0.305: v17.8,8.9 17.8,7.51 JP1.3 JP1.1 | v21,12.77 21,14.2 25.8,19 U3.5
  Bottom 0.305: v17.8,8.9 17.8,9.33 21,12.53 v21,12.77
OK_HYST
  Top 0.305: R9.1 29,13.85 | R10.2 29,12.15 29,13.85 | U3.10 29,13.85
OK_PROG
  Top 0.305: R8.2 R10.1 29.75,13.1 U3.11
RSN2  (via drill 0.35)
  Bottom 0.406: U2.8 45.93,20.32 45.16,19.54 R3.P$3 | C14.1 47.95,15.95 v47.5,15.5
  other vias: 47.5,16.5 46.5,16.5 46.5,15.5 45.5,15.5 45.5,16.5
  pour Top (isolate 0.305, rank 3): 37.5,0 37.5,9.5 41,13 41,18 56,18 56,0
  pour Bottom (isolate 0.305, no thermals): 48.5,19.5 48.5,14.8 44.5,14.8 44.5,17.5 46.2,17.5 46.2,19.5
RSP1  (via drill 0.3)
  Top 0.305: R16.2 37.35,41.5 22,41.5
  Bottom 0.406: C16.1 11.05,50 v13,50 | U1.7 20.67,44.83 17.54,47.96 R11.P$3
  other vias: 15,51 14,51 13,51 15,50 14,50
  pour Top (isolate 0.305): 0,41 22.5,41 22.5,43 19,46.5 16.1,46.5 16.1,51.7 12,51.7 12,46.5 0,46.5
  pour Bottom (isolate 0.305, no thermals): 16.1,51.7 16.1,49 14.3,49 14.3,47 12,47 12,51.7
RSP1_DIV
  Top 0.305: R16.1 R17.2 42.15,44.35 44,42.5 | 44,42.5 SJ11.2 | TP16.TP 39.5,38 44,42.5
S1
  Top 0.305: U6.2 49,42.87 47.11,40.98 SJ11.3
S2
  Top 0.305: SJ12.1 47.11,50.02 49,48.13 U6.9
S3
  Top 0.305: SJ14.3 50,40.52 U6.4
S4
  Top 0.305: SJ15.1 50,50.48 U6.7
SCLK
  Top 0.305: 74.5,40 74.5,41.7 70.88,45.33 U7.3 | R15.1 74,39.5 74.5,40 | TP22.TP 74.5,40
SDO
  Top 0.305: 72.8,39.35 71.5,40.65 R23.1 | 72.8,39.35 72.8,32.1 74.4,30.5 J7.4 | TP21.TP 72.8,40.3 72.8,39.35
SW
  Top 0.406: U4.4 64.65,7.95 73.19,7.95 J6.1
V+
  Top 0.406: SJ9.1 57.38,8.12 | 57.38,8.12 59.26,10 63,10 | 63,10 64.15,8.85 U4.5 | C19.1 64.55,11.55 63,10 | U4.2 57.4,8.1 57.38,8.12
VBAT  (via drill 0.3, 0.6)
  Top 0.305: 28.24,23.1 28,22.86 U3.18 | R18.2 36.85,48.35 v31.5,43
  Top 0.813: v29,24.5 28.24,23.74 28.24,23.1
  Bottom 0.305: JP1.2 20.31,5 8,5 2.5,10.5 2.5,32.5 4.27,34.27 J4.2 | v31.5,43 26,37.5 19.5,37.5 18.1,36.1 18,36.1
  Bottom 0.406: J4.2 4.5,32.77 TP6.TP
  Bottom 0.813: J4.2 12.77,34.27 14.6,36.1 18,36.1 C18.1 21.05,36.05 29.95,36.05 32.5,33.5 32.5,28 v29,24.5
VBAT_DIV
  Top 0.305: R18.1 R19.2 41.65,46.65 43.5,48.5 | 43.5,48.5 SJ12.2 | 43.5,48.5 41,51 TP19.TP
VBAT_OK  (via drill 0.35)
  Top 0.305: v32.6,19.1 31.7,20 U3.13
  Bottom 0.305: JP2.4 7.01,17.28 20.28,17.28 22,19 | TP7.TP 22,19 | 22,19 23.5,19 26,16.5 31.5,16.5 32.6,17.6 v32.6,19.1
VBAT_OV
  Top 0.305: R5.2 R4.1 27.5,16.35 U3.7
VCC_SW  (via drill 0.6)
  Top 0.406: 67.5,16 67.5,18.74 SJ6.1 | 67.5,16 70.74,19.24 SJ7.1 | 67.5,16 71.5,16 74,18.5 SJ8.1 | 67.5,16 65,18.5 SJ5.1 | 67.25,15.75 67,16 64.5,16 62,18.5 SJ4.1
  Top 0.61: 67.5,16 67.25,15.75 66,14.5 57.5,14.5 56.5,13.5 SJ3.2 56.5,11 v57.5,10 | v58.5,5 60,3.5 F1.1
  Bottom 0.61: v57.5,10 58.5,9 v58.5,5
VCC_SW1  (via drill 0.3, 0.4)
  Top 0.305: v63.5,20 62.74,20.76 SJ4.2
  Top 0.406: SJ4.2 60.74,20.76 v43.5,38 | v30,47.5 28,47.5 v27,48.5
  Bottom 0.305: v63.5,20 63.5,18.5 TP26.TP
  Bottom 0.406: U1.1 20,48.19 20,50 | v43.5,38 35.5,46 31.5,46 | 31.5,46 v30,47.5 | v27,48.5 C2.2 | R6.1 28.5,43 31.5,46
  Bottom 1.27: C2.2 C3.2 20.55,50.55 20,50
VCC_SW2  (via drill 0.3, 0.4)
  Top 0.305: SJ5.2 65.74,20.76 v66.5,20
  Top 0.406: SJ5.2 65,21.5 64,22.5 | 64,22.5 v59,27.5 | v61,22.5 64,22.5
  Bottom 0.305: v66.5,20 66.5,18.5 TP25.TP
  Bottom 0.406: C4.2 56.55,27.5 v59,27.5 | R7.1 60.85,22.5 v61,22.5 | U2.1 52.01,26.06 52.5,26.55
  Bottom 1.27: C4.2 C5.2 52.5,26.55
VCC_SW3  (via drill 0.3, 0.4)
  Top 0.254: 68.74,20.76 v69.5,20
  Top 0.305: SJ6.2 68.74,20.76 | U6.5 50.5,43 v51.5,42 | v55.5,41.5 58.49,41.5 58.5,41.5
  Top 0.406: SJ6.2 68,27.5 62.49,33.01 62.49,37.5 58.5,41.5 v54.5,45.49 v54.5,45.5
  Bottom 0.305: v69.5,20 69.5,18.5 TP13.TP | v55.5,41.5 52,41.5 v51.5,42
  Bottom 0.406: v54.5,45.5 53,47 | 53,47 v51.5,48.5 | C21.1 53,47
  pour Top (isolate 0.305, rank 2): 50.5,50.5 50.5,47 52.1,47 54.7,49.6 54.7,50.5
VCC_SW4  (via drill 0.3)
  Top 0.305: SJ7.2 71.74,20.76 v72.5,20
  Top 0.406: U5.5 65.15,42.1 C20.1 65.05,33.95 71,28 SJ7.2
  Bottom 0.305: v72.5,20 72.5,18.5 TP15.TP
VCC_SW5  (via drill 0.3, 0.4)
  Top 0.305: SJ8.2 74.74,20.76 v75.5,20 | C23.2 74.05,46 U7.4 | U7.6 70,47.5 70.5,48
  Top 0.406: SJ8.2 74.26,20.76 v77,23.5
  Bottom 0.305: v75.5,20 75.5,18.5 TP18.TP | v77,47 79,47 76,50 76,52 75,53 71.5,53 70.7,52.2 v70.7,51.2
  Bottom 0.406: 79,47 79,25.5 v77,23.5
  pour Top (isolate 0.305, rank 2, no thermals): 70,55 70,46 85,46 85,55
VIN_DC  (via drill 0.3, 0.35)
  Top 0.305: v22.8,22.2 24.5,20.5 U3.2
  Bottom 0.305: v22.4,25.3 22.4,22.6 v22.8,22.2
  Bottom 0.406: C13.1 11.05,40 v13,40 | U1.8 13.82,43.82 12.8,42.8 R11.P$1
  other vias: 15,40 14,40 13,39 14,39 15,39
  pour Top (isolate 0.305, rank 2): 7.5,24.4 7.5,41 22.5,41 22.5,35 18,35 18,27 22.5,27 23.5,26 23.5,24.4
  pour Bottom (isolate 0.305, no thermals): 16,43 16,38.3 12,38.3 12,41 14,41 14,43
  pour Bottom (isolate 0.305, no thermals): 16.1,43 16.1,38.3 12,38.3 12,41 13.9,41 13.9,43
VOC_SAMP  (via drill 0.35)
  Top 0.305: v22.99,18.01 24.98,20 U3.3 | v23,13 v23,15
  Bottom 0.305: v22.99,18.01 v23,18 v23,15 | JP1.9 JP1.7 JP1.5 23,12.77 v23,13
VOUT  (via drill 0.35, 0.6)
  Top 0.305: 30.9,20.8 30.6,20.5 U3.14
  Top 0.813: v32.2,20.8 30.9,20.8
  Bottom 0.305: v39.7,20.5 39,21.2 v40.4,21.2
  Bottom 0.406: U2.7 52.67,21.83 49.99,24.51 R3.P$1 | C17.1 47.55,27.55 v47.5,27.5
  Bottom 0.813: v32.2,20.8 38.6,20.8 39,21.2
  other vias: 47.5,26.5 46.5,27.5 45.5,27.5 45.5,26.5 46.5,26.5
  pour Top (isolate 0.305, rank 2): 38,34.5 42.5,34.5 43.5,33.5 43.5,23.5 44,23.5 44,28.5 48.5,28.5 56,21 56,18 41,18 38,21
  pour Bottom (isolate 0.305, no thermals): 48.5,28.2 48.5,25.5 46.7,25.5 46.7,23.5 44.4,23.5 44.4,28.2
VOUT_EN  (via drill 0.35)
  Top 0.305: v16.05,13.45 v16.04,13.46 JP2.1 JP2.3 JP2.5 | v24.5,15.5 27,18 U3.6
  Bottom 0.305: v16.05,13.45 22.45,13.45 v24.5,15.5
VOUT_SET
  Top 0.305: R12.1 35.05,18.1 R13.2 32.35,18.15 31,19.5 U3.12
VRDIV  (via drill 0.35)
  Top 0.305: R4.2 24.93,12.07 | 24.93,12.07 25.93,13.07 | R9.2 25.93,11.22 25.93,13.07 | 25.93,13.07 v28,15.15 U3.8 | v31,14 R12.2 | v24.92,10.54 v24.93,10.54 24.93,12.07
  Bottom 0.305: v28,15.15 29.15,14 v31,14 | v24.92,10.54 24.92,5.58 TP8.TP
VREF_SAMP
  Top 0.305: C1.1 21.15,15 25.65,19.5 U3.4
VSTOR  (via drill 0.35)
  Top 0.305: v14,9 15.24,7.76 15.24,4.99 JP1.6 | v14,16 v14,18.5 | C11.1 v24.5,32 26.78,34.28 TP5.TP | 27.05,23.26 27.5,22.81 U3.19
  Top 1.27: 27.05,23.26 C8.1 C9.1 C11.1
  Bottom 0.305: v14,18.5 13,19.5 13,24 21,32 v24.5,32 | v14,9 v14,16 12.93,14.93 7.2,14.93 JP2.2

### Text on the board
tPlace: B | A | A | B | A | B | + | - | IN | A | A | B | + | - | BAT | GND | SCLK | SDO | !CS! | A1 | A0 | GND | VBAT_OK | A | GND | VSTOR | B | SW | MPPT | + | OUT | - | + | OUT | - | + | OSWF | - | VOUT_EN | 50% | X% | 80% | EN | DIS
bPlace: Designed by Robbe Elsas | CC BY-SA 3.0 | Energy Harvesting Monitor V2.0